# Altium schematic sheet 02_MCU_ANALOG.SchDoc: =GlobalProjectName
size 594 x 420 mm; CheckedBy: A_D; Author: A_D; SheetNumber: 2; SheetTotal: 2; PageSetup: Record=PageOptions|CenterHorizontal=True|CenterVertical=True|PrintScale=0.70|XCorrection=1.00|YCorrection=1.00|PrintKind=2|BorderSize=5000000|LeftOffset=9000|BottomOffset=10100|Orientation=2|PaperLength=11176|PaperWidth=8636|Scale=100|PaperSource=259|PrintQuality=-3|MediaType=1|DitherType=10|PrintScaleMode=1|PaperKind=A3|PaperIndex=8
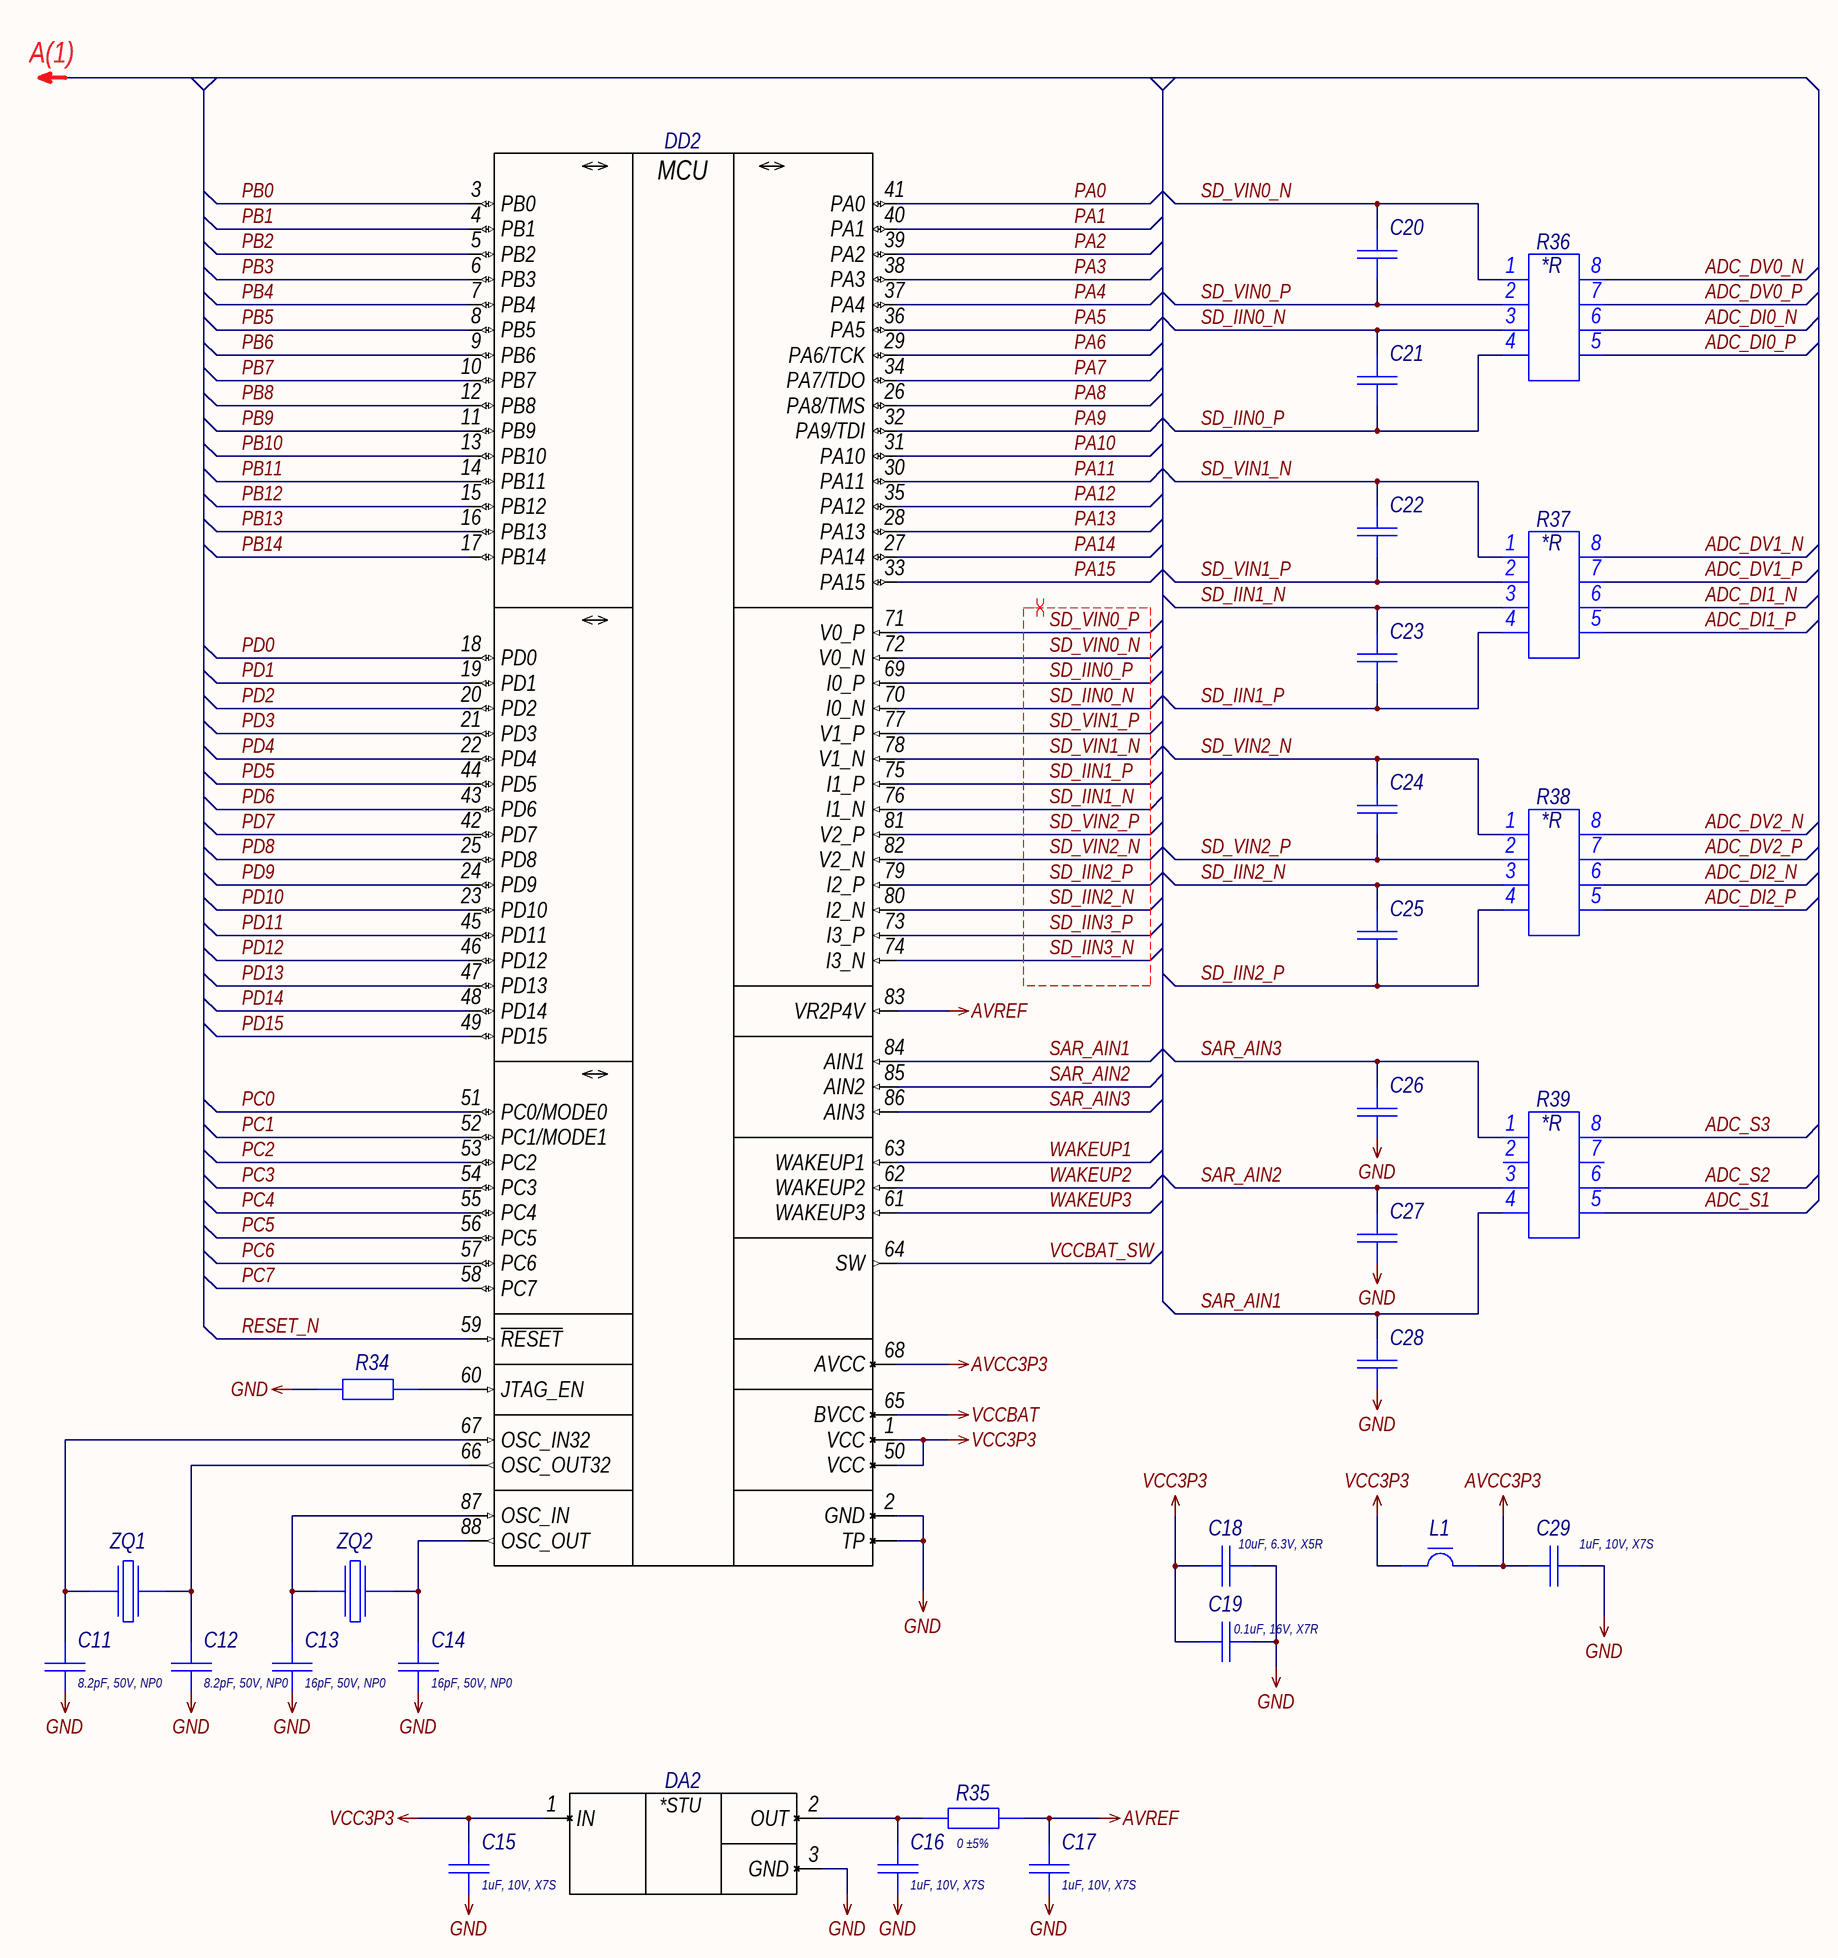
[diagram p0: 02_MCU_ANALOG.SchDoc]

## Parts
C11  Schematic Value: 8.2pF, 50V, NP0  [C0402_100X050H050_H]  (hidden comment: Capacitor)
C12  Schematic Value: 8.2pF, 50V, NP0  [C0402_100X050H050_H]  (hidden comment: Capacitor)
C13  Schematic Value: 16pF, 50V, NP0  [C0402_100X050H050_H]  (hidden comment: Capacitor)
C14  Schematic Value: 16pF, 50V, NP0  [C0402_100X050H050_H]  (hidden comment: Capacitor)
C15  Schematic Value: 1uF, 10V, X7S  [C0402_100X050H050_H]  (hidden comment: Capacitor)
C16  Schematic Value: 1uF, 10V, X7S  [C0402_100X050H050_H]  (hidden comment: Capacitor)
C17  Schematic Value: 1uF, 10V, X7S  [C0402_100X050H050_H]  (hidden comment: Capacitor)
C18  Schematic Value: 10uF, 6.3V, X5R  [C0402_100X050H050_H]  (hidden comment: Capacitor)
C19  Schematic Value: 0.1uF, 16V, X7R  [C0402_100X050H050_H]  (hidden comment: Capacitor)
C20  Capacitor  [C0201_060X030H030_H]  (value not drawn)
C21  Capacitor  [C0201_060X030H030_H]  (value not drawn)
C22  Capacitor  [C0201_060X030H030_H]  (value not drawn)
C23  Capacitor  [C0201_060X030H030_H]  (value not drawn)
C24  Capacitor  [C0201_060X030H030_H]  (value not drawn)
C25  Capacitor  [C0201_060X030H030_H]  (value not drawn)
C26  Capacitor  [C0201_060X030H030_H]  (value not drawn)
C27  Capacitor  [C0201_060X030H030_H]  (value not drawn)
C28  Capacitor  [C0201_060X030H030_H]  (value not drawn)
C29  Schematic Value: 1uF, 10V, X7S  [C0402_100X050H050_H]  (hidden comment: Capacitor)
DA2  REF33xxAIDBZx-Series  [SOT-23_190P290X160X145_N]  (value not drawn)
DD2  1986ВК025-Series  [QFN-88_040P1000X1000X080_N]  (value not drawn)
L1  FerriteBead  [L0402_100X050H050_H]  (value not drawn)
R34  Resistor  [R0402_100X050H035_H]  (value not drawn)
R35  Schematic Value: 0 ±5%  [R0402_100X050H035_H]  (hidden comment: Resistor)
R36  Resistor-4  [CAY10-x4]  (value not drawn)
R37  Resistor-4  [CAY10-x4]  (value not drawn)
R38  Resistor-4  [CAY10-x4]  (value not drawn)
R39  Resistor-4  [CAY10-x4]  (value not drawn)
ZQ1  Crystal  [SX-3215]  (value not drawn)
ZQ2  Crystal-1_3p  [SMD 3.2x2.5mm]  (value not drawn)

## Nets
AVCC3P3: C29.2 DD2.68(AVCC) L1.2
AVREF: C17.2 DD2.83(VR2P4V) R35.1
GND: C11.1 C12.1 C13.1 C14.1 C15.1 C16.1 C17.1 C18.1 C19.2 C26.1 C27.1 C28.1 C29.1 DA2.3(GND) DD2.2(GND) DD2.TP R34.2
VCC3P3: C15.2 C18.2 C19.1 DA2.1(IN) DD2.1(VCC) DD2.50(VCC) L1.1
VCCBAT: DD2.65(BVCC)
ADC_DI0_N: R36.6
ADC_DI0_P: R36.5
ADC_DI1_N: R37.6
ADC_DI1_P: R37.5
ADC_DI2_N: R38.6
ADC_DI2_P: R38.5
ADC_DV0_N: R36.8
ADC_DV0_P: R36.7
ADC_DV1_N: R37.8
ADC_DV1_P: R37.7
ADC_DV2_N: R38.8
ADC_DV2_P: R38.7
ADC_S1: R39.5
ADC_S2: R39.6
ADC_S3: R39.8
PA0: DD2.41(PA0)
PA1: DD2.40(PA1)
PA2: DD2.39(PA2)
PA3: DD2.38(PA3)
PA4: DD2.37(PA4)
PA5: DD2.36(PA5)
PA6: DD2.29(PA6/TCK)
PA7: DD2.34(PA7/TDO)
PA8: DD2.26(PA8/TMS)
PA9: DD2.32(PA9/TDI)
PA10: DD2.31(PA10)
PA11: DD2.30(PA11)
PA12: DD2.35(PA12)
PA13: DD2.28(PA13)
PA14: DD2.27(PA14)
PA15: DD2.33(PA15)
PB0: DD2.3(PB0)
PB1: DD2.4(PB1)
PB2: DD2.5(PB2)
PB3: DD2.6(PB3)
PB4: DD2.7(PB4)
PB5: DD2.8(PB5)
PB6: DD2.9(PB6)
PB7: DD2.10(PB7)
PB8: DD2.12(PB8)
PB9: DD2.11(PB9)
PB10: DD2.13(PB10)
PB11: DD2.14(PB11)
PB12: DD2.15(PB12)
PB13: DD2.16(PB13)
PB14: DD2.17(PB14)
PC0: DD2.51(PC0/MODE0)
PC1: DD2.52(PC1/MODE1)
PC2: DD2.53(PC2)
PC3: DD2.54(PC3)
PC4: DD2.55(PC4)
PC5: DD2.56(PC5)
PC6: DD2.57(PC6)
PC7: DD2.58(PC7)
PD0: DD2.18(PD0)
PD1: DD2.19(PD1)
PD2: DD2.20(PD2)
PD3: DD2.21(PD3)
PD4: DD2.22(PD4)
PD5: DD2.44(PD5)
PD6: DD2.43(PD6)
PD7: DD2.42(PD7)
PD8: DD2.25(PD8)
PD9: DD2.24(PD9)
PD10: DD2.23(PD10)
PD11: DD2.45(PD11)
PD12: DD2.46(PD12)
PD13: DD2.47(PD13)
PD14: DD2.48(PD14)
PD15: DD2.49(PD15)
RESET_N: DD2.59(~{RESET})
SAR_AIN1: C28.2 DD2.84(AIN1) R39.4
SAR_AIN2: C27.2 DD2.85(AIN2) R39.3
SAR_AIN3: C26.2 DD2.86(AIN3) R39.1
SD_IIN0_N: C21.2 DD2.70(I0_N) R36.3
SD_IIN0_P: C21.1 DD2.69(I0_P) R36.4
SD_IIN1_N: C23.2 DD2.76(I1_N) R37.3
SD_IIN1_P: C23.1 DD2.75(I1_P) R37.4
SD_IIN2_N: C25.2 DD2.80(I2_N) R38.3
SD_IIN2_P: C25.1 DD2.79(I2_P) R38.4
SD_IIN3_N: DD2.74(I3_N)
SD_IIN3_P: DD2.73(I3_P)
SD_VIN0_N: C20.2 DD2.72(V0_N) R36.1
SD_VIN0_P: C20.1 DD2.71(V0_P) R36.2
SD_VIN1_N: C22.2 DD2.78(V1_N) R37.1
SD_VIN1_P: C22.1 DD2.77(V1_P) R37.2
SD_VIN2_N: C24.2 DD2.82(V2_N) R38.1
SD_VIN2_P: C24.1 DD2.81(V2_P) R38.2
VCCBAT_SW: DD2.64(SW)
WAKEUP1: DD2.63(WAKEUP1)
WAKEUP2: DD2.62(WAKEUP2)
WAKEUP3: DD2.61(WAKEUP3)
NetC11_2: C11.2 DD2.67(OSC_IN32) ZQ1.1
NetC12_2: C12.2 DD2.66(OSC_OUT32) ZQ1.3
NetC13_2: C13.2 DD2.87(OSC_IN) ZQ2.1
NetC14_2: C14.2 DD2.88(OSC_OUT) ZQ2.3
NetC16_2: C16.2 DA2.2(OUT) R35.2
NetDD2_60: DD2.60(JTAG_EN) R34.1

Not connected (* = marked no-connect by the designer): R39 2 7

## Layout directives
differential pair: SD_IIN0_N, SD_IIN0_P, SD_IIN1_N, SD_IIN1_P, SD_IIN2_N, SD_IIN2_P, SD_IIN3_N, SD_IIN3_P, SD_VIN0_N, SD_VIN0_P, SD_VIN1_N, SD_VIN1_P, SD_VIN2_N, SD_VIN2_P

## Notes on the sheet
- А(1)
- Подп. и дата
- Инв. № дубл.
- Взам. инв. №
- Инв. № подл.
- Изм.
- Лист
- № докум.
- Подп.
- Дата
- Форма 2а ГОСТ 2.104-2006
- Копировал
- Формат А2
- (in symbol CAY10-101J4LF) *R
- (in symbol REF3325AIDBZR) *STU
- (in symbol К1986ВК025) MCU

## Library data of the parts
C11 C12 = GCM1555C1H8R2CA16D: Manufacturer: Murata; Type: Конденсатор; ID: 195; Value: 8.2pF; Voltage: 50V; Tolerance: ±0.25pF; Dielectric Type: NP0; Application Category: 1; Working Temperature Min: -55°С; Working Temperature Max: +125°С; Functional Analog: GRM1555C1H8R2CA01D, GCM1555C1H8R2CA16J, GCM1555C1H8R2CA16W; Published: 18.05.2010; Publisher: Andrew Danich; Part Number: GCM1555C1H8R2CA16D; Footprint: 0402
C13 C14 = GRM1555C1H160JA01D: Manufacturer: Murata; Type: Конденсатор; ID: 192; Value: 16pF; Voltage: 50V; Tolerance: ±5%; Dielectric Type: NP0; Application Category: 1; Working Temperature Min: -55°С; Working Temperature Max: +125°С; Functional Analog: GRM1555C1H160JA01J, GRM1555C1H160JA01W; Published: 18.05.2010; Publisher: Andrew Danich; Part Number: GRM1555C1H160JA01D; Footprint: 0402
C15-C17 C29 = GRM155C71A105KE11D: Manufacturer: Murata; Type: Конденсатор; ID: 179; Value: 1uF; Voltage: 10V; Tolerance: ±10%; Dielectric Type: X7S; Application Category: 1; Working Temperature Min: -55°С; Working Temperature Max: +125°С; Functional Analog: GRM155C71A105KE11J; Published: 18.05.2010; Publisher: Andrew Danich; Part Number: GRM155C71A105KE11D; Footprint: 0402
C18 = GRM155R60J106ME15D: Manufacturer: Murata; Type: Конденсатор; ID: 234; Value: 10uF; Voltage: 6.3V; Tolerance: ±20%; Dielectric Type: X5R; Application Category: 1; Working Temperature Min: -55°С; Working Temperature Max: +85°С; Functional Analog: GRM155R60J106ME15J; Published: 18.05.2010; Publisher: Andrew Danich; Part Number: GRM155R60J106ME15D; Footprint: 0402
C19 = GCM155R71C104KA55D: Manufacturer: Murata; Type: Конденсатор; ID: 163; Value: 0.1uF; Voltage: 16V; Tolerance: ±10%; Dielectric Type: X7R; Application Category: 1; Working Temperature Min: -55°С; Working Temperature Max: +125°С; Functional Analog: GRM155R71C104KA88D, GCM155R71C104KA55J, GCM155R71C104KA55W; Published: 18.05.2010; Publisher: Andrew Danich; Part Number: GCM155R71C104KA55D; Footprint: 0402
C20-C28 = GRM033R71A472KA01D: Manufacturer: Murata; Type: Конденсатор; Schematic Value: 4700pF, 10V, X7R; ID: 245; Value: 4700pF; Voltage: 10V; Tolerance: ±10%; Dielectric Type: X7R; Application Category: 1; Working Temperature Min: -55°С; Working Temperature Max: +125°С; Functional Analog: GRM033R71A472KA01EA01, GRM033R71A472KA01J, GRM033R71A472KA01W; Published: 18.05.2010; Publisher: Andrew Danich; Part Number: GRM033R71A472KA01D; Footprint: 0201
DA2 = REF3325AIDBZR: Manufacturer: Texas Instruments; ID: 25; Input Voltage: +2.68…5.5V; Output Current: 5mA; Output Voltage: +2.5V; Temperature Coefficient: 30ppm; Supply Current: 8.5uA; Noise: 70μV p-p; Application Category: 1; Working Temperature Min: -40°С; Working Temperature Max: +125°С; Functional Analog: REF3325AIDBZT; Published: 28.06.2020; Publisher: Andrew Danich; Type: Микросхема; Part Number: REF3325AIDBZR; Value: REF3325AIDBZR
DD2 = К1986ВК025: Manufacturer: Миландр; ID: 2; Supply Operation: +3.0…3.6V; Flash: 256+8Kb; SRAM: 112Kb; Prog Interface: JTAG; I/O Lines: 55; Operation Frequency: 60MHz; Application Category: 1; Working Temperature Min: -50°С; Working Temperature Max: +85°С; Published: 18.12.2020; Publisher: Andrew Danich; Type: Микросхема; Part Number: К1986ВК025; Value: К1986ВК025; EEPROM: -
L1 = BLM15HD102SN1D: Manufacturer: Murata; Type: Дроссель; Schematic Value: 1000ohm ±25%; ID: 7; Rated Current: 250mA; Impedance at 100Mhz: 1000ohm; Tolerance: ±25%; DC Resistance: 1.25ohm; Inductor Type: EMIFIL; Application Category: 1; Working Temperature Min: -55°С; Working Temperature Max: +125°С; Functional Analog: BLM15HD102SN1B; Published: 14.11.2014; Publisher: Andrew Danich; Part Number: BLM15HD102SN1D; Value: BLM15HD102SN1D; Footprint: 0402
R34 = RC0402JR-070RL: Manufacturer: Yageo; ID: 362; Value: 0; Limit Voltage: 50V; Tolerance: ±5%; Temperature Coefficient: 100ppm; Total Power Dissipation: 0.1W; Series Type: Thick-Film; Application Category: 1; Working Temperature Min: -55°С; Working Temperature Max: +155°С; Schematic Value: 0 ±5%; Published: 24.03.2010; Publisher: Andrew Danich; Type: Резистор; Part Number: RC0402JR-070RL; Footprint: 0402
R35 = RC0402JR-070RL: Manufacturer: Yageo; ID: 362; Value: 0; Limit Voltage: 50V; Tolerance: ±5%; Temperature Coefficient: 100ppm; Total Power Dissipation: 0.1W; Series Type: Thick-Film; Application Category: 1; Working Temperature Min: -55°С; Working Temperature Max: +155°С; Published: 24.03.2010; Publisher: Andrew Danich; Type: Резистор; Part Number: RC0402JR-070RL; Footprint: 0402
R36-R39 = CAY10-101J4LF: Manufacturer: Bourns; Schematic Value: 100 ±5%; ID: 26; Value: 100; Limit Voltage: 50V; Tolerance: ±5%; Temperature Coefficient: 200ppm; Total Power Dissipation: 0,031W; Series Type: Thick-Film; Application Category: 1; Working Temperature Min: -55°С; Working Temperature Max: +125°С; Published: 15.07.2014; Publisher: Andrew Danich; Type: Набор резисторов; Part Number: CAY10-101J4LF
ZQ1 = SX-3215 32.768KHz: ID: 16; Shunt Capacitance: 1.2pF; Load Capacitance: 9pF; Application Category: 1; Published: 08.03.2013; Publisher: Andrew Danich; Type: Резонатор; Part Number: SX-3215 32.768KHz; Value: SX-3215 32.768KHz; Output Frequency: 32.768KHz
ZQ2 = 12.88602_KX-7-16.0MHz: Manufacturer: GEYER ELECTRONIC; ID: 23; Output Frequency: 16МГц; Load Capacitance: 10pF; Temperature Coefficient: ±30ppm; Application Category: 1; Working Temperature Min: -20°С; Working Temperature Max: +70°С; Published: 12.09.2014; Publisher: Andrew Danich; Type: Резонатор; Part Number: 12.88602_KX-7-16.0MHz; Value: 12.88602_KX-7-16.0MHz; Functional Analog: -